# Altium schematic sheet CAN.SchDoc
size A; SheetNumber: 3; SheetTotal: 4
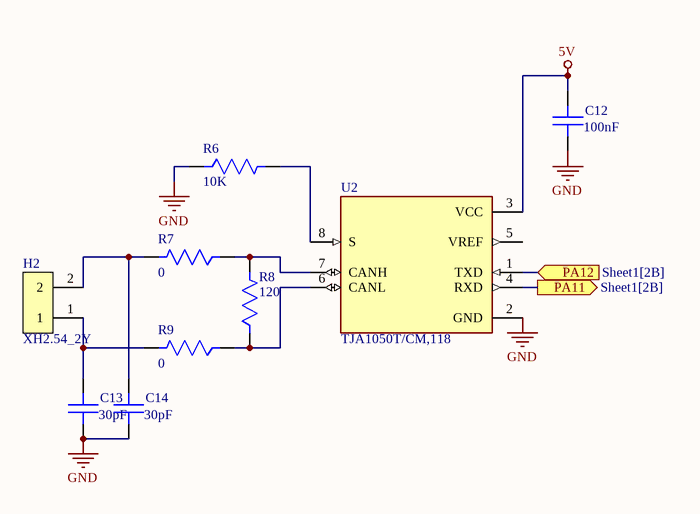
[diagram p0: CAN.SchDoc]

## Parts
C12  100nF  [C0603]
C13  30pF  [C0603]
C14  30pF  [C0603]
H2  XH2.54_2Y  [JST-XH-02-PACKAGE-LONG-PAD]
R6  10K  [R0603]
R7  0  [R0603]
R8  120  [R0603]
R9  0  [R0603]
U2  TJA1050T/CM,118  [SOIC127P600X175-8N]

## Ports
PA11 (out, see Sheet1[2B]), PA12 (in, see Sheet1[2B])

## Nets
5V: C12.1 U2.3(VCC)
GND: C12.2 C13.2 C14.2 R6.1 U2.2(GND)
PA11: U2.4(RXD) ; port PA11
PA12: U2.1(TXD) ; port PA12
NetC13_1: C13.1 H2.1 R9.2
NetC14_1: C14.1 H2.2 R7.2
NetR6_2: R6.2 U2.8(S)
NetR7_1: R7.1 R8.2 U2.7(CANH)
NetR8_1: R8.1 R9.1 U2.6(CANL)

Not connected (* = marked no-connect by the designer): U2 5(VREF)

## Library data of the parts
C12-C14 = Capacitor 0603
R6-R9 = Resistor 0603: SMD Resistor 0603; Manufacturer: Yageo; Manufacturer Part Number: RC0603FR-071KL; Power Rating: 100mW; Tolerance: 1%; Temperature Coefficient: 100ppm/°C; Voltage Rating: 50V; Supplier: Digi-Key; Supplier Part Number: 311-1.00KHRDKR-ND; RoHS: Yes; Category: Chip SMD Resistors; Stock: 18662657; Pricing: 1=0.1, 10=0.018, 50=0.0106, 100=0.0088, 500=0.00592, 1000=0.00505 (USD); Case/Package: 0603; Case Code (Imperial): 0603; Case Code (Metric): 1608; Contact Plating: Tin,Matte; Min Operating Temperature: -55°C; Max Operating Temperature: 155°C; Packaging: Tape and Reel; Resistor Type: Thick Film; Termination: SMD/SMT; Features: Moisture Resistant; Series: RC; Max Power Dissipation: 100mW; Number of Terminations: 2; Resistance Tolerance: 1%; Construction: Rectangular; Technology: THICK FILM; Length: 1.6mm; Height: 0.45mm; Depth: 0.8mm; Reach SVHC Compliant: No; Military Standard: Not; Lead Free: 5697LeadFree; RoHS Compliant: Yes
U2 = TJA1050T/CM,118: 1/1 Transceiver Half CANbus 8-SO; MF: NXP USA; SnapEDA_Link: https://www.snapeda.com/parts/TJA1050T/CM,118/NXP%20USA%20Inc./view-part/304529/?ref=snap; Value: *; Purchase-URL: https://pricing.snapeda.com/search/part/TJA1050T/CM,118/?ref=eda; Check_prices: https://www.snapeda.com/parts/TJA1050T/CM,118/NXP%20USA%20Inc./view-part/304529/?ref=eda; Price: None; Availability: In Stock; MP: TJA1050T/CM,118; Package: SO-8 NXP Semiconductors